# Altium schematic sheet WL_BPF.SchDoc
size 420 x 297 mm; SheetNumber: 8; SheetTotal: 9
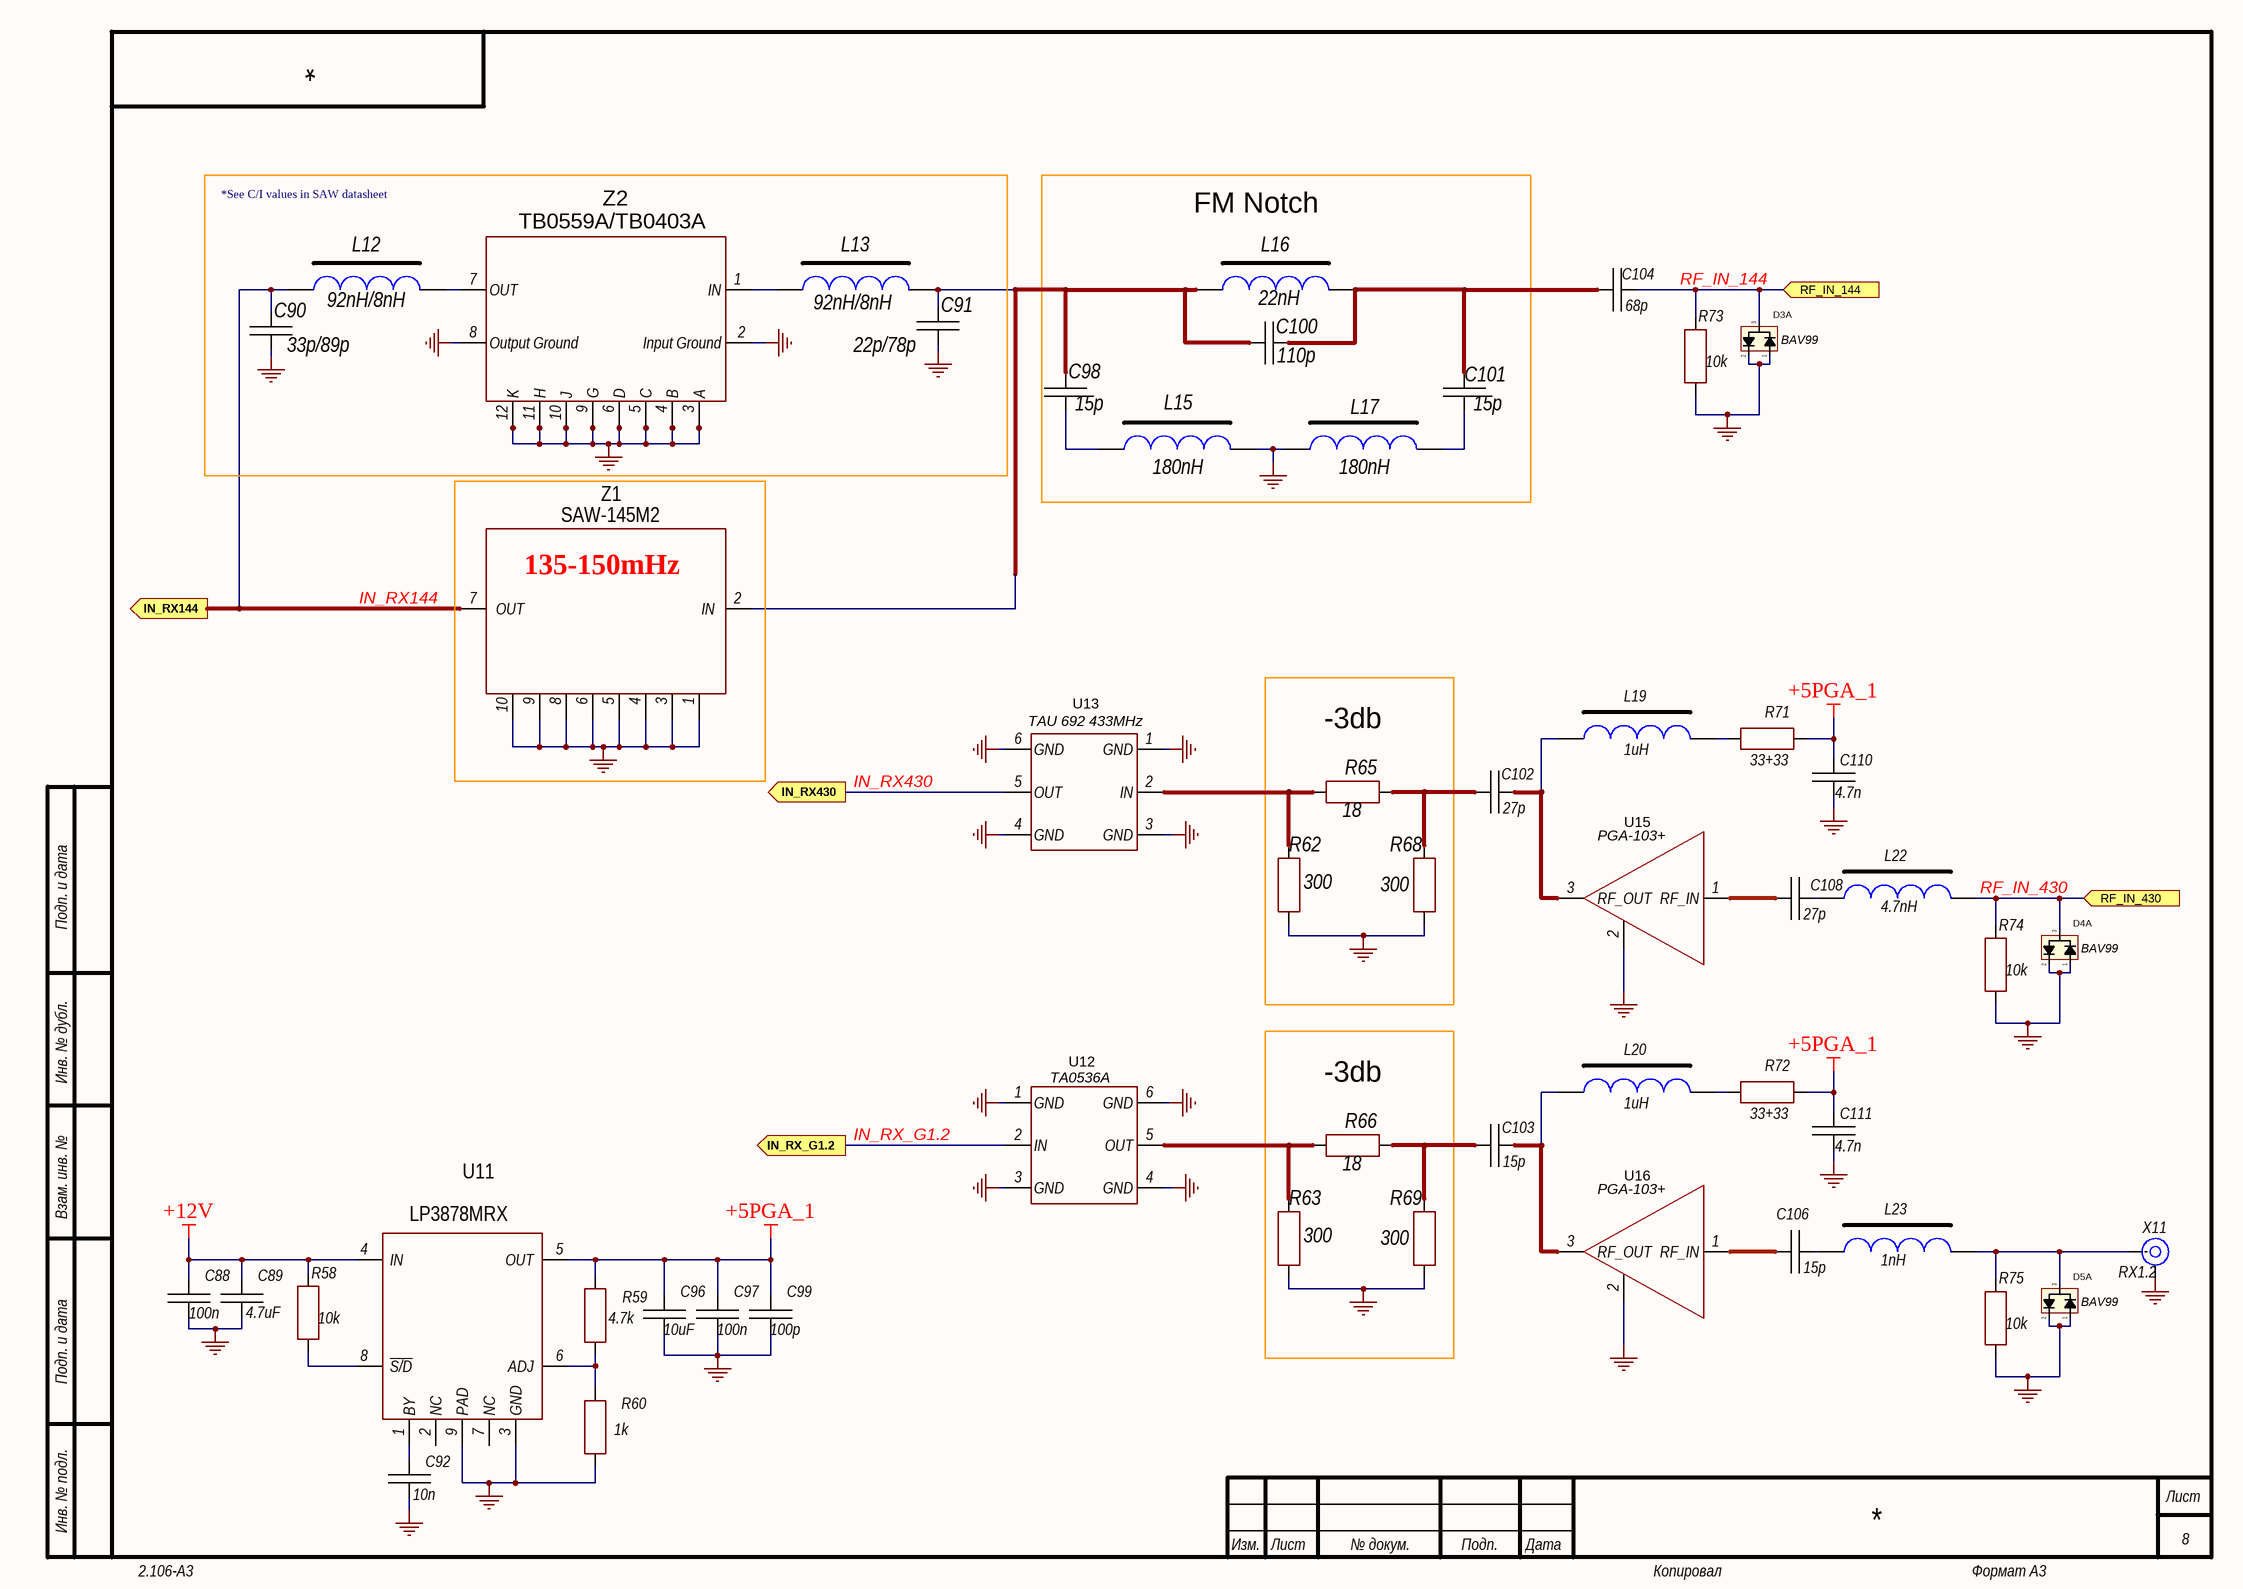
[diagram p0: WL_BPF.SchDoc]

## Parts
C88  100n  [CH0805C]
C89  4.7uF  [CH0805C]
C90  33p/89p  [CH0805C]
C91  22p/78p  [CH0805C]
C92  10n  [CH0805C]
C96  10uF  [CH0805C]
C97  100n  [CH0805C]
C98  15p  [CH0805C]
C99  100p  [CH0805C]
C100  110p  [CH0805C]
C101  15p  [CH0805C]
C102  27p  [CH0805C]
C103  15p  [CH0603C]
C104  68p  [CH0805C]
C106  15p  [CH0603C]
C108  27p  [CH0805C]
C110  4.7n  [CH0805C]
C111  4.7n  [CH0805C]
D3  BAV99  [SOT23_132]  (part A of 2)
D4  BAV99  [SOT23_132]  (part A of 2)
D5  BAV99  [SOT23_132]  (part A of 2)
L12  92nH/8nH  [L1210]
L13  92nH/8nH  [L1210]
L15  180nH  [L1210]
L16  22nH  [L1210]
L17  180nH  [L1210]
L19  1uH  [L1210]
L20  1uH  [L1210]
L22  4.7nH  [L1210]
L23  1nH  [L1210]
R58  10k  [CH0805R]
R59  4.7k  [CH0805R]
R60  1k  [CH0805R]
R62  300  [CH0805R]
R63  300  [CH0603R]
R65  18  [CH0805R]
R66  18  [CH0603R]
R68  300  [CH0805R]
R69  300  [CH0603R]
R71  33+33  [CH1206R]
R72  33+33  [CH1206R]
R73  10k  [CH0805R]
R74  10k  [CH0805R]
R75  10k  [CH0805R]
U11  LP3878MRX  [8-SOIC (PAD)]
U12  TA0536A  [MA08803]
U13  TAU 692 433MHz  [TAU692]
U15  PGA-103+  [SOT89_123]
U16  PGA-103+  [SOT89_123]
X11  RX1.2  [CON: u.Fl]
Z1  SAW-145M2  [PAV]
Z2  TB0559A/TB0403A  [TB0559A/TB0403A]

## Blocks framed on the sheet
*See C/I values in SAW datasheet: C90 C91 L12 L13 Z2
FM Notch: C98 C100 C101 L15-L17
135-150mHz: Z1
-3db: R62 R65 R68
-3db: R63 R66 R69

## Ports
IN_RX144 (out), IN_RX430 (out), IN_RX_G1.2 (out), RF_IN_144 (in), RF_IN_430 (in)

## Nets
+5PGA_1: C96.2 C97.2 C99.2 C110.2 C111.2 R59.2 R71.2 R72.2 U11.5(OUT)
+12V: C88.2 C89.2 R58.2 U11.4(IN)
GND: C88.1 C89.1 C90.1 C91.1 C92.1 C96.1 C97.1 C99.1 C110.1 C111.1 D3.1 D3.2 D4.1 D4.2 D5.1 D5.2 L15.2 L17.1 R60.1 R62.2 R63.2 R68.2 R69.2 R73.1 R74.1 R75.1 U11.3(GND) U11.9(PAD) U12.1(GND) U12.3(GND) U12.4(GND) U12.6(GND) U13.1(GND) U13.3(GND) U13.4(GND) U13.6(GND) U15.2(GND) U16.2(GND) X11.2(IN) Z1.1(RESET) Z1.3(CH_PD) Z1.4(GPIO16) Z1.5(GPIO14) Z1.6(GPIO0) Z1.8(GPIO5) Z1.9(RXD) Z1.10(TXD) Z2.2(Input_Ground) Z2.3(A) Z2.4(B) Z2.5(C) Z2.6(D) Z2.8(Output_Ground) Z2.9(G) Z2.10(J) Z2.11(H) Z2.12(K)
IN_RX144: C90.2 L12.1 Z1.7(OUT) ; port IN_RX144
IN_RX430: U13.5(OUT) ; port IN_RX430
IN_RX_G1.2: U12.2(IN) ; port IN_RX_G1.2
RF_IN_144: C104.2 D3.3 R73.2 ; port RF_IN_144
RF_IN_430: D4.3 L22.1 R74.2 ; port RF_IN_430
NetC91_2: C91.2 C98.2 C100.1 L13.2 L16.1 Z1.2(IN)
NetC92_2: C92.2 U11.1(BY)
NetC98_1: C98.1 L15.1
NetC100_2: C100.2 C101.2 C104.1 L16.2
NetC101_1: C101.1 L17.2
NetC102_1: C102.1 R65.1 R68.1
NetC102_2: C102.2 L19.2 U15.3(RF_OUT)
NetC103_1: C103.1 R66.1 R69.1
NetC103_2: C103.2 L20.2 U16.3(RF_OUT)
NetC106_1: C106.1 U16.1(RF_IN)
NetC106_2: C106.2 L23.2
NetC108_1: C108.1 U15.1(RF_IN)
NetC108_2: C108.2 L22.2
NetD5_3: D5.3 L23.1 R75.2 X11.1(IN)
NetL12_2: L12.2 Z2.7(OUT)
NetL13_1: L13.1 Z2.1(IN)
NetL19_1: L19.1 R71.1
NetL20_1: L20.1 R72.1
NetR58_1: R58.1 U11.8(~{S/D})
NetR59_1: R59.1 R60.2 U11.6(ADJ)
NetR62_1: R62.1 R65.2 U13.2(IN)
NetR63_1: R63.1 R66.2 U12.5(OUT)

Not connected (* = marked no-connect by the designer): U11 2(NC) 7(NC)

## Notes on the sheet
- Подп. и дата
- Инв. № дубл.
- Взам. инв. №
- Инв. № подл.
- Изм.
- Лист
- № докум.
- Подп.
- Дата
- 2.106-A3
- Копировал
- Формат А3

## Library data of the parts
C88-C92 C96-C104 C106 C108 C110 C111 = Capacitor: Manufacturer: *; Model: *; HelpURL: *; ComponentKind: *; Value: *
L12 L13 L15-L17 L19 L20 L22 L23 = TRANS
R58-R60 R62 R63 R65 R66 R68 R69 R71-R75 = Resistor: Manufacturer: *; Model: *; HelpURL: *; ComponentKind: *; Value: *
U11 = LP3878
U12 U13 = TAU692
X11 = SMA: RF; Model: *; Manufacturer: *; HelpURL: *; ComponentKind: *
Z1 = SXBP_PAW